# Altium project RS232转485通讯模块.PRJPCB
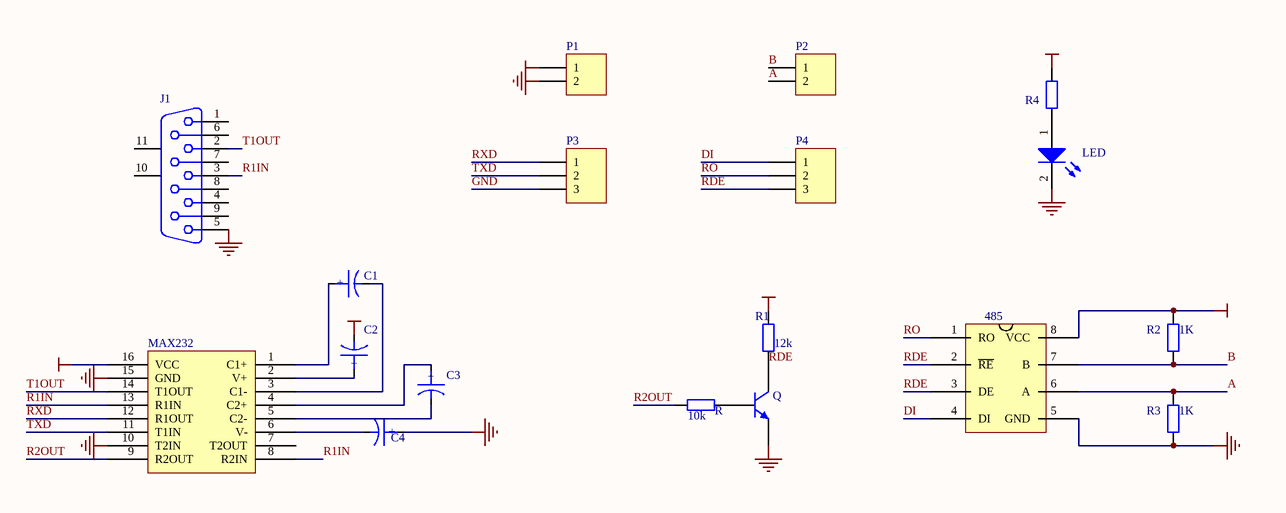
[diagram p0: RS232转485通讯模块.SCHDOC]
1 sheet, 18 parts. Net scope: global (net labels, ports and power ports of the same name join across sheets).
Board file: RS232转485通讯模块.PCBDOC

## Sheet RS232转485通讯模块.SCHDOC
size A4

### Parts
485  (no value)  [DIP-8]
C1  (no value)  [C-DJ-4]
C2  (no value)  [C-DJ-4]
C3  (no value)  [C-DJ-4]
C4  (no value)  [C-DJ-4]
J1  (no value)  [DSUB1.385-2H9]
LED  (no value)  [TP-0805-D]
MAX232  (no value)  [DIP16]
P1  (no value)  [JK128_2]
P2  (no value)  [JK128_2]
P3  (no value)  [HDR-3]
P4  (no value)  [HDR-3]
Q  (no value)  [SO-G3]
R  10k  [TP-0805-R]
R1  12k  [TP-0805-R]
R2  1K  [TP-0805-R]
R3  1K  [TP-0805-R]
R4  (no value)  [TP-0805-R]

### Nets
GND: 485.5(GND) C4.1 J1.5 LED.2(K) MAX232.10(T2IN) MAX232.15(GND) P1.2 P3.3 Q.2(E) R3.2
VCC: 485.8(VCC) C2.2 MAX232.16(VCC) P1.1 R1.2 R2.1 R4.2
A: 485.6(A) P2.2 R3.1
B: 485.7(B) P2.1 R2.2
DI: 485.4(DI) P4.1
R1IN: J1.3 MAX232.8(R2IN) MAX232.13(R1IN)
R2OUT: MAX232.9(R2OUT) R.1
RDE: 485.2(~{RE}) 485.3(DE) P4.3 Q.3(C) R1.1
RO: 485.1(RO) P4.2
RXD: MAX232.12(R1OUT) P3.1
T1OUT: J1.2 MAX232.14(T1OUT)
TXD: MAX232.11(T1IN) P3.2
NetC1_1: C1.1 MAX232.1(C1+)
NetC1_2: C1.2 MAX232.3(C1-)
NetC2_1: C2.1 MAX232.2(V+)
NetC3_1: C3.1 MAX232.4(C2+)
NetC3_2: C3.2 MAX232.5(C2-)
NetC4_2: C4.2 MAX232.6(V-)
NetLED_1: LED.1(A) R4.1
NetQ_1: Q.1(B) R.2

Not connected (* = marked no-connect by the designer): J1 1 4 6 7 8 9 10(MH1) 11(MH2); MAX232 7(T2OUT)

### Notes on the sheet
- (in symbol CAPACITOR POL) +

### Library data of the parts
485 = 485芯片
C1-C4 = CAPACITOR POL: Capacitor
J1 = D Connector 9: Receptacle Assembly, 9 Position, Right Angle; Package Information: Latest Revision: O; Positions: 9; Published: 15-Jun-2001; Revision: 17-Jul-2002: Re-released for DXP Platform.; Datasheet: (1-Sep-1999); Package Reference: 788750; Publisher: Altium Limited; Orientation: Right Angle; Gender: Receptacle
LED = LED: 发光二极管; Published: 8-Jun-2000; LatestRevisionDate: 17-Jul-2002; LatestRevisionNote: Re-released for DXP Platform.; Publisher: Altium Limited
MAX232 = MAX232
P1 P2 = PZ_2: 排针——2; LatestRevisionDate: 17-Jul-2002; LatestRevisionNote: Re-released for DXP Platform.; Publisher: Altium Limited
P3 P4 = PZ_3: 排针——3; LatestRevisionDate: 17-Jul-2002; LatestRevisionNote: Re-released for DXP Platform.; Publisher: Altium Limited
Q = TPSJG_NPN: 贴片三极管——NPN; Published: 8-Jun-2000; LatestRevisionDate: 15-Jan-2003; LatestRevisionNote: PCB Footprint 'BCY-W3/D4.7' replaced; DatasheetDocument: 1997; PackageReference: TO-92A; Publisher: Altium Limited; Code_JEDEC: TO-92A
R R1-R4 = Res: 电阻; Published: 8-Jun-2000; LatestRevisionDate: 17-Jul-2002; LatestRevisionNote: Re-released for DXP Platform.; Publisher: Altium Limited